# EAGLE design SparkFun_IMU_Breakout_ICM-20948 (EAGLE 9.6.2)
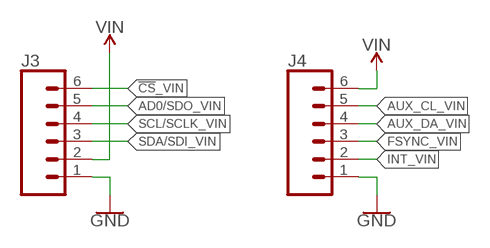
[diagram p0: schematic, sheet 1]

## Parts
J3  CONN_06NO_SILK_NO_POP  [1X06_NO_SILK]
J4  CONN_06NO_SILK_NO_POP  [1X06_NO_SILK]

## Nets
!CS!_VIN: J3.6
AD0/SDO_VIN: J3.5
AUX_CL_VIN: J4.5
AUX_DA_VIN: J4.4
FSYNC_VIN: J4.3
GND: J3.1 J4.1
INT_VIN: J4.2
SCL/SCLK_VIN: J3.4
SDA/SDI_VIN: J3.3
VIN: J3.2 J4.6

## Library data of the parts
J3 J4 = SparkFun-Connectors:CONN_06: Multi connection point. Often used as Generic Header-pin footprint for 0.1 inch spaced/style header connections On any of the 0.1 inch spaced packages, you can populate with these: Break Away Headers - Straight <https://www.sparkfun.com/products/116> (PRT-00116) Break Away Male Headers - Right Angle <https://www.sparkfun.com/products/553> (PRT-00553) Female Headers <https://www.sparkfun.com/products/115> (PRT-00115) Break Away Headers - Machine Pin <https://www.sparkfun.com/products/117> (PRT-00117) Break Away Female Headers - Swiss Machine Pin <https://www.sparkfun.com/products/743> (PRT-00743) Arduino Stackable Header - 6 Pin <https://www.sparkfun.com/products/9280> (PRT-09280) For SCREWTERMINALS and SPRING TERMINALS visit here: Screw Terimnals on SparkFun.com <https://www.sparkfun.com/search/results?term=Screw+Terminals> (5mm/3.5mm/2.54mm spacing) This device is also useful as a general connection point to wire up your design to another part of your project. Our various solder wires solder well into these plated through hole pads. Hook-Up Wire - Assortment (Stranded, 22 AWG) <https://www.sparkfun.com/products/11375> (PRT-11375) Hook-Up Wire - Assortment (Solid Core, 22 AWG) <https://www.sparkfun.com/products/11367> (PRT-11367) View the entire wire category on our website here <https://www.sparkfun.com/categories/141>

## Board
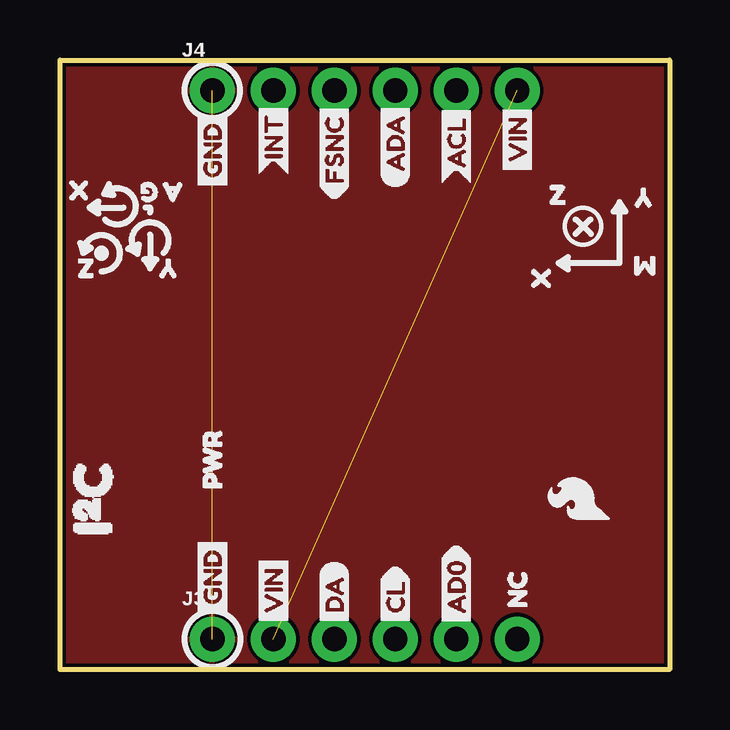
[diagram p1: board, top side]
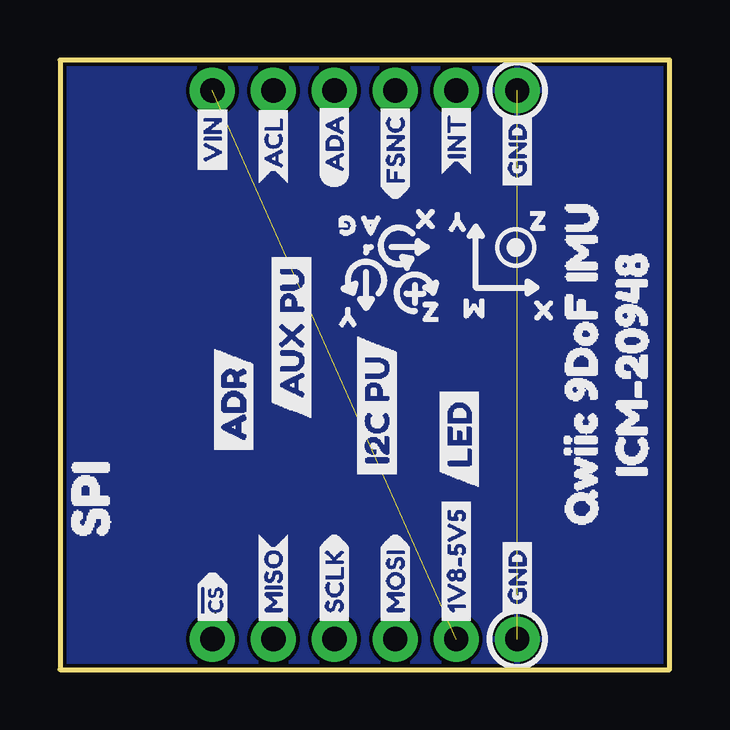
[diagram p2: board, bottom side, seen from below]

Size 25.4 x 25.4 mm. Coordinates in mm from the lower left corner, seen from the top.
Outline: 0,0 0,25.4 25.4,25.4 25.4,0 0,0
Copper layers (1*16): Top 0.035mm / dielectric 1.5mm / Bottom 0.035mm
Design rules "SparkFun-2-layer-FAB-LIMIT": minimum track width 4mil, minimum drill 6mil, track to track 4mil, track to pad 4mil, pad to pad 4mil, via to via 4mil, smd to smd 4mil, copper to edge 4mil, drill to drill 4mil, minimum pad ring 5mil, minimum via ring 5mil, stop-mask expansion 4mil, vias tented up to drill 25mil, thermal gap 10mil

### Footprints (pad centres in the part's own frame; a part is rotated, then mirrored left to right if it is on the bottom)
1X06_NO_SILK = drill 1.016 pad 1.88: 1 0,0; 2 2.54,0; 3 5.08,0; 4 7.62,0; 5 10.16,0; 6 12.7,0

### Placement (x,y rotation side)
J3  6.35,1.27 0 top
J4  6.35,24.13 0 top
U$1  [GND4]  6.35,2.03 90 bottom
U$2  [GND4]  6.35,19.81 90 bottom
U$3  [PWR0]  6.35,6.86 90 top
U$4  [INT3]  8.89,20.57 90 bottom
U$5  [FSNC2]  11.43,19.56 90 bottom
U$6  [ACL1]  16.51,20.19 90 bottom
U$7  [ADA0]  13.97,20.07 90 bottom
U$8  [MISO13]  16.51,1.65 90 bottom
U$9  [MOSI14]  11.43,1.65 90 bottom
U$10  [SCLK15]  13.97,1.65 90 bottom
U$11  [#CS16]  19.05,1.52 90 bottom
U$12  [1V8#5V57]  8.89,1.65 90 bottom
U$13  [VIN5]  8.89,1.65 90 top
U$14  [NC17]  19.05,1.91 90 top
U$15  [CL4]  13.97,1.65 90 top
U$16  [DA2]  11.43,1.65 90 top
U$17  [AD012]  16.51,1.65 90 top
U$18  [ADA0]  13.97,20.07 90 top
U$19  [ACL1]  16.51,20.19 90 top
U$20  [FSNC2]  11.43,19.56 90 top
U$21  [INT3]  8.89,20.57 90 top
U$22  [GND4]  6.35,2.03 90 top
U$23  [ADR2]  18.16,8.64 90 bottom
U$24  [GND4]  6.35,19.81 90 top
U$25  [I2C_PU21]  12.19,7.62 90 bottom
U$26  [SPI19]  24.13,4.19 90 bottom
U$27  [AUX_PU24]  15.75,10.41 90 bottom
U$28  [SFE_LOGO_FLAME_.1]  21.59,7.11 90 top
U$29  [LED23]  8.76,7.49 90 bottom
U$30  [VIN5]  19.05,20.45 90 top
U$31  [ICM#2094820]  1.59,6.92 90 bottom
U$34  [X0]  1.85,19.96 180 top
U$35  [Y1]  5.54,16.71 180 top
U$36  [Z2]  2.11,16.71 180 top
U$37  [G5]  4.78,19.89 180 top
U$38  [A4]  5.79,19.89 180 top
U$39  [M3]  25.52,16.82 180 top
U$40  [X0]  20.04,15.22 90 top
U$41  [Y1]  25.34,19.66 180 top
U$42  [Z2]  19.69,19.79 0 top
U$43  [QWIIC_9DOF_IMU_0]  3.68,4.89 90 bottom
U$44  [VIN5]  19.05,20.45 90 bottom
U$45  [I#C1]  1.37,4.25 90 top
U$49  [M3]  6.99,15.04 180 bottom
U$50  [X0]  4.17,14.96 180 bottom
U$51  [Y1]  7.81,18.64 180 bottom
U$52  [Z2]  4.45,18.69 180 bottom
U$57  [X0]  11.25,18.77 0 bottom
U$58  [Y1]  12.37,14.68 180 bottom
U$59  [Z2]  11,14.91 0 bottom
U$60  [G5]  12.37,18.49 180 bottom
U$61  [A4]  11.35,18.49 180 bottom

### Tracks (layer width: path | path; a pad name or v marks a point on that pad's centre or on a via)
GND  (1 unrouted)
  pour Top (isolate 0.152): 0,25.4 25.4,25.4 25.4,0 0,0
  pour Bottom (isolate 0.152): 0,25.4 25.4,25.4 25.4,0 0,0
VIN  (1 unrouted)